# Altium project cycloon.PrjPcb
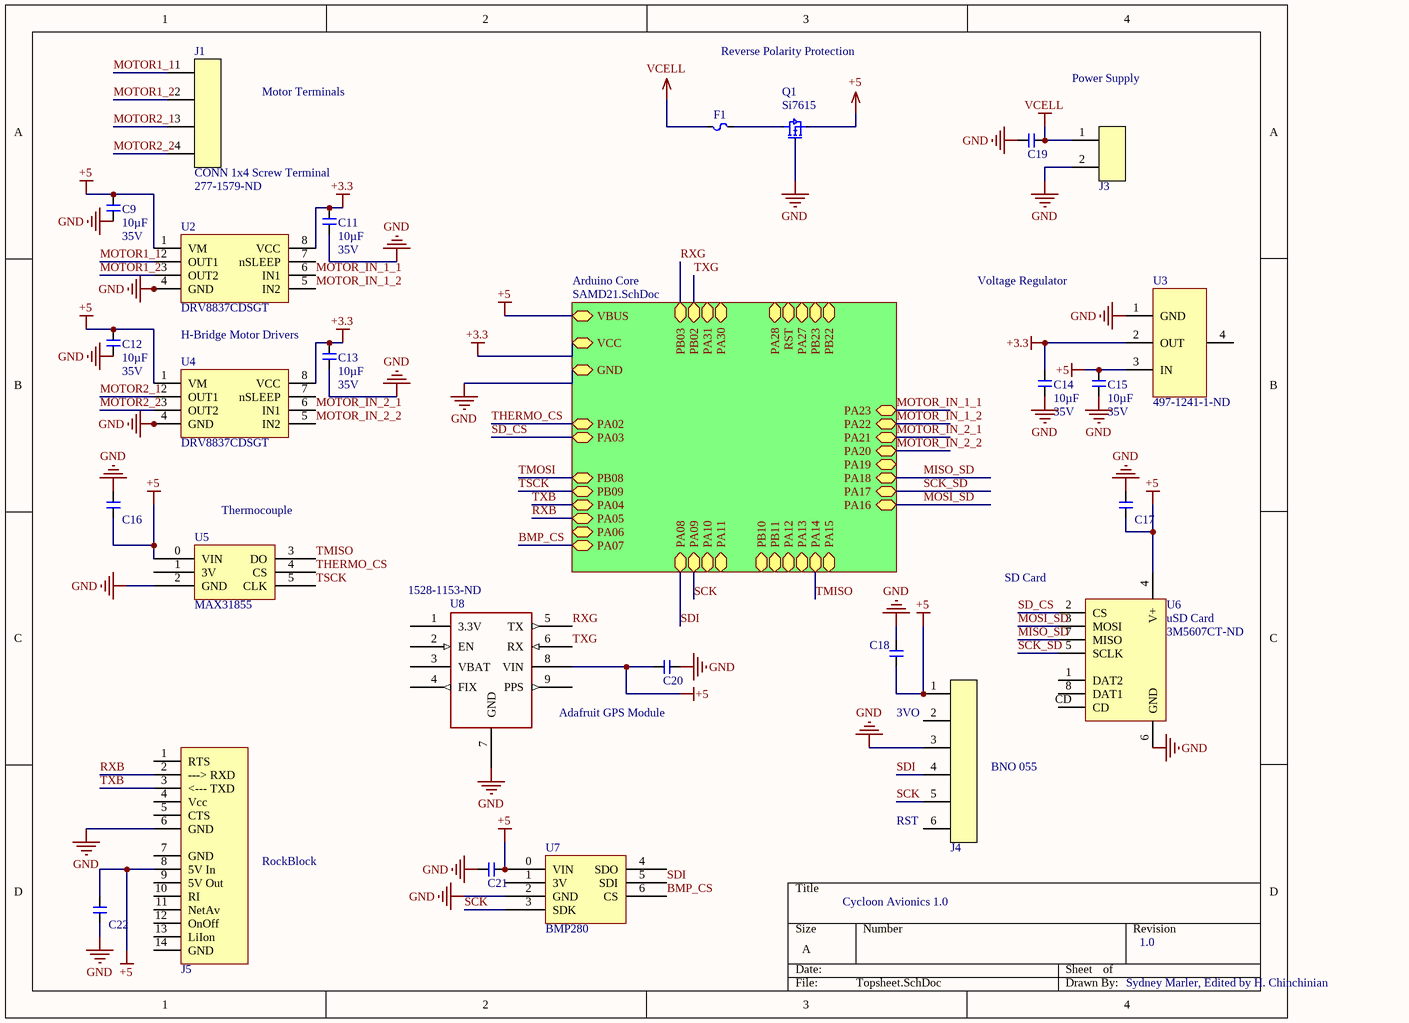
[diagram p0: Topsheet.SchDoc]
2 sheets, 43 parts. Net scope: hierarchical (ports join the sheet entries above them; power ports are global).
Board file: cycloonboard.PcbDoc
Sheets:
  Topsheet.SchDoc
    Arduino Core = SAMD21.SchDoc

## Sheet Topsheet.SchDoc
size A

### Parts
C9  Capacitance (shorthand): 10µF  Rated Voltage: 35V  [C0603]  (hidden comment: __template_cap)
C11  Capacitance (shorthand): 10µF  Rated Voltage: 35V  [C0603]  (hidden comment: __template_cap)
C12  Capacitance (shorthand): 10µF  Rated Voltage: 35V  [C0603]  (hidden comment: __template_cap)
C13  Capacitance (shorthand): 10µF  Rated Voltage: 35V  [C0603]  (hidden comment: __template_cap)
C14  Capacitance (shorthand): 10µF  Rated Voltage: 35V  [C0603]  (hidden comment: __template_cap)
C15  Capacitance (shorthand): 10µF  Rated Voltage: 35V  [C0603]  (hidden comment: __template_cap)
C16  __template_cap  [C0603]  (value not drawn)
C17  __template_cap  [C0603]  (value not drawn)
C18  __template_cap  [C0603]  (value not drawn)
C19  __template_cap  [C0603]  (value not drawn)
C20  __template_cap  [C0603]  (value not drawn)
C21  __template_cap  [C0603]  (value not drawn)
C22  __template_cap  [C0603]  (value not drawn)
F1  __template_fuse  [R1206]  (value not drawn)
J1  CONN 1x4 Screw Terminal  Supplier Part Number 1: 277-1579-ND  [CONN_1x4_5mm]
J3  CONN HEADER 2POS VERT T/H  [CONN_1x2_100MIL]  (value not drawn)
J4  CONN HEADER 6POS T/H  [CONN_1x6_100MIL]  (value not drawn)
J5  ROCKBLOCK_V2  [ROCKBLOCK_V2]  (value not drawn)
Q1  Si7615  [POWERPAK_1212-8_SINGLE]
U2  DRV8837CDSGT  [8WSON]
U3  Supplier Part Number 1: 497-1241-1-ND  [4SOT223]  (hidden comment: LDO_LD1117S33CTR)
U4  DRV8837CDSGT  [8WSON]
U5  MAX31855  [ADAFRUIT_THERMOCOUPLE_BREAKOUT]
U6  uSD Card  Supplier Part Number 1: 3M5607CT-ND  [MICROSD_CARD_SOCKET]
U7  BMP280  [ADAFRUIT_BMP280_BREAKOUT]
U8  Adafruit GPS Module  Supplier Part Number 1: 1528-1153-ND  [adafruit_gps_746]

### Sub-sheets
Arduino Core = SAMD21.SchDoc: PB10 (bidir), PA15 (bidir), PA12 (bidir), GND (bidir), RST (bidir), PA28 (bidir), PA08 (bidir), PA09 (bidir), PA10 (bidir), VCC (bidir), PA11 (bidir), PB11 (bidir), PA13 (bidir), PA14 (bidir), PA02 (bidir), PA03 (bidir), PB08 (bidir), PB09 (bidir), PA04 (bidir), PA05 (bidir), PA06 (bidir), PA07 (bidir), PA17 (bidir), PA18 (bidir), PA19 (bidir), PA20 (bidir), PA21 (bidir), PA22 (bidir), PA23 (bidir), PA30 (bidir), PB23 (bidir), PB22 (bidir), PA27 (bidir), PA31 (bidir), VBUS (bidir), PB03 (bidir), PB02 (bidir), PA16 (bidir)

### Nets
+3.3: C11.1 C13.1 C14.1 U2.8(VCC) U3.2(OUT) U4.8(VCC) ; sheet Arduino Core/VCC  [project net VCC]
+5: C9.1 C12.1 C15.1 C16.2 C17.2 C18.2 C20.1 C21.2 C22.1 J4.1 J5.8(5V_In) Q1.2 U2.1(VM) U3.3(IN) U4.1(VM) U5.0(VIN) U6.4(V+) U7.0(VIN) U8.8(VIN) ; sheet Arduino Core/VBUS  [project net VBUS]
GND: C9.2 C11.2 C12.2 C13.2 C14.2 C15.2 C16.1 C17.1 C18.1 C19.1 C20.2 C21.1 C22.2 J3.2 J4.3 J5.6(GND) Q1.1 U2.4(GND) U2.PAD U3.1(GND) U4.4(GND) U4.PAD U5.2(GND) U6.6(GND) U7.2(GND) U8.7(GND) ; sheet Arduino Core/GND  [project net AGND]
VCELL: C19.2 F1.1 J3.1
BMP_CS: U7.6(CS) ; sheet Arduino Core/PA07
MISO_SD: U6.7(MISO) ; sheet Arduino Core/PA18
MOSI_SD: U6.3(MOSI) ; sheet Arduino Core/PA16
MOTOR1_1: J1.1 U2.2(OUT1)
MOTOR1_2: J1.2 U2.3(OUT2)
MOTOR2_1: J1.3 U4.2(OUT1)
MOTOR2_2: J1.4 U4.3(OUT2)
MOTOR_IN_1_1: U2.6(IN1) ; sheet Arduino Core/PA23
MOTOR_IN_1_2: U2.5(IN2) ; sheet Arduino Core/PA22
MOTOR_IN_2_1: U4.6(IN1) ; sheet Arduino Core/PA21
MOTOR_IN_2_2: U4.5(IN2) ; sheet Arduino Core/PA20
RXB: J5.2(--->_RXD) ; sheet Arduino Core/PA05
RXG: U8.5(TX) ; sheet Arduino Core/PB03
SCK: J4.5 U7.3(SDK) ; sheet Arduino Core/PA09
SCK_SD: U6.5(SCLK) ; sheet Arduino Core/PA17
SD_CS: U6.2(CS) ; sheet Arduino Core/PA03
SDI: J4.4 U7.5(SDI) ; sheet Arduino Core/PA08
THERMO_CS: U5.4(CS) ; sheet Arduino Core/PA02
TMISO: U5.3(DO) ; sheet Arduino Core/PA14
TSCK: U5.5(CLK) ; sheet Arduino Core/PB09
TXB: J5.3(<---_TXD) ; sheet Arduino Core/PA04
TXG: U8.6(RX) ; sheet Arduino Core/PB02
NetF1_2: F1.2 Q1.3

Not connected (* = marked no-connect by the designer): J4 2 6; J5 1(RTS) 4(Vcc) 5(CTS) 7(GND) 9(5V_Out) 10(RI) 11(NetAv) 12(OnOff) 13(LiIon) 14(GND); U2 7(nSLEEP); U3 4(GND); U4 7(nSLEEP); U5 1(3V); U6 1(DAT2) 8(DAT1) CD; U7 1(3V) 4(SDO); U8 1(3.3V) 2(EN) 3(VBAT) 4(FIX) 9(PPS)

### Notes on the sheet
- Motor Terminals
- Reverse Polarity Protection
- Power Supply
- Voltage Regulator
- (near C13) H-Bridge Motor Drivers
- (near U5) Thermocouple
- (near U6) SD Card
- 3VO
- (near J4) BNO 055
- (near J4) RST
- RockBlock
- Cycloon Avionics 1.0
- 1.0
- Sydney Marler, Edited by H. Chinchinian

### Library data of the parts
C9 C11-C15 = 490-13248-1-ND: CAP CER 10UF 35V X5R 0603 20%; Manufacturer: Murata Electronics North America; Capacitance - pF (Machine readable): #NAME?; type: capacitor; Supplier Part Number 1: 490-13248-1-ND; Dielectric: X5R; Supplier 1: Digikey
F1 = CMP-035-0003-1: Source: fuse.SchLib; Design Item ID: __template_fuse
J1 = CONN_1x4_PhoenixContact_1935187: CONN 1x4 Screw Terminal: Phoenix Contact 1935187; ComponentLink1Description: Digikey part; ComponentLink1URL: https://www.digikey.com/product-detail/en/phoenix-contact/1935187/277-1579-ND/568616; Supplier 1: Digi-Key
J3 = CONN_1x2: Manufacturer: FCI; Manufacturer Part Number: 77311-118-02LF; Connector Type: Header, Unshrouded; Number of Positions: 2; Number of Positions Loaded: All; Pitch: 0.100" (2.54mm); RoHS: RoHS Compliant; Category: Connectors, Interconnects; Packaging: Bulk; Contact Type: Male Pin; Number of Rows: 1; Mounting Type: Through Hole; Termination: Solder; Fastening Type: -; Features: -; ComponentLink1URL: http://portal.fciconnect.com/res/en/pdffiles/doc_search//77311.pdf; ComponentLink1Description: http://portal.fciconnect.com/res/en/pdffiles/doc_search//77311.pdf; Row Spacing: -; Contact Mating Length: 0.230" (5.84mm); Contact Finish: Gold, GXT™; Contact Finish Thickness: 30µin (0.76µm); Color: Black
J4 = CONN_1x6
J5 = ROCKBLOCK_V2: CHILD OF SATAN, SOURCE OF BOTH TREMENDOUS FORTUNE AND UNSPEAKABLE ANGUISH; ComponentLink1Description: Developer's Guide; ComponentLink1URL: https://www.rock7.com/downloads/RockBLOCK-Developer-Guide-Mk2.pdf
Q1 = PFET_SI7615ADN-T1: MOSFET P-CH 20V 35A PPK; pin to pad: 1>4 2>1 3>5; Manufacturer: Vishay Siliconix; Manufacturer Part Number: SI7615ADN-T1-GE3; FET Type: MOSFET P-Channel, Metal Oxide; FET Feature: Standard; Current - Continuous Drain (Id) @ 25°C: 35A (Tc); Rds On (Max) @ Id, Vgs: 4.4 mOhm @ 20A, 10V; Vgs(th) (Max) @ Id: 1.5V @ 250µA; Gate Charge (Qg) @ Vgs: 183nC @ 10V; Input Capacitance (Ciss) @ Vds: 5590pF @ 10V; Power - Max: 52W; Supplier 1: Digi-Key; Supplier Part Number 1: SI7615ADN-T1-GE3CT-ND; RoHS: RoHS Compliant; Category: Discrete Semiconductor Products; Stock 1: 98451; Pricing 1: 1=0.73, 10=0.646, 25=0.6068, 100=0.4951, 250=0.45988, 500=0.3914, 1000=0.31312 (USD); Packaging: Cut Tape (CT); Part Status: Active; Drain to Source Voltage (Vdss): 20V; Operating Temperature: -55°C ~ 150°C (TJ); Mounting Type: Surface Mount; Package / Case: PowerPAK® 1212-8; Supplier Device Package: PowerPAK® 1212-8; ComponentLink1URL: http://www.vishay.com/docs/62667/si7615adn.pdf; ComponentLink1Description: http://www.vishay.com/docs/62667/si7615adn.pdf
U2 U4 = MOTOR_HBRIDGE_DRV8837C: MOTOR DRIVER 1A; Manufacturer: Texas Instruments; Output Configuration: Half Bridge (2); Interface: PWM; Load Type: Inductive; Rds On (Typ): 1 Ohm LS + HS; Voltage - Supply: 1.8 V ~ 7 V; Voltage - Load: 0 V ~ 11 V; Fault Protection: Current Limiting, Over Temperature, Short Circuit, UVLO; Supplier 1: Digi-Key; Manufacturer Part Number: DRV8837CDSGT; RoHS: RoHS Compliant; Category: Integrated Circuits (ICs); Stock 1: 1424; Pricing 1: 1=1.28, 10=1.146, 100=0.8931 (USD); Packaging: Cut Tape (CT); Part Status: Active; Applications: DC Motors, Solenoids; Technology: NMOS; Current - Output / Channel: -; Current - Peak Output: 1A; Operating Temperature: -40°C ~ 150°C (TJ); Features: -; Mounting Type: Surface Mount; Package / Case: 8-WFDFN Exposed Pad; Supplier Device Package: 8-WSON (2x2); ComponentLink1URL: http://www.ti.com/lit/ds/symlink/drv8837c.pdf; ComponentLink1Description: http://www.ti.com/lit/ds/symlink/drv8837c.pdf; Supplier Part Number 1: 296-44747-1-ND
U3 = LDO_LD1117S33CTR: IC VOLTAGE REG 3.3V 800MA SOT223 INDUSTRIAL TEMP; Manufacturer: STMicroelectronics; Regulator Topology: Positive Fixed; Voltage - Dropout (Typical): 1.1V @ 800mA; Number of Regulators: 1; Voltage - Input: Up to 15V; Supplier 1: Digi-Key; Manufacturer Part Number: LD1117S33CTR; RoHS: RoHS Compliant; Category: Integrated Circuits (ICs); Stock 1: 63873; Pricing 1: 1=0.46, 10=0.373, 100=0.2538, 500=0.19034, 1000=0.14276 (USD); Packaging: Cut Tape (CT); Part Status: Active; Voltage - Output: 3.3V; Current - Output: 800mA; Current - Limit (Min): -; Operating Temperature: -40°C ~ 125°C; Mounting Type: Surface Mount; Package / Case: TO-261-4, TO-261AA; Supplier Device Package: SOT-223; ComponentLink1URL: http://www.st.com/content/ccc/resource/technical/document/datasheet/99/3b/7d/91/91/51/4b/be/CD00000544.pdf/files/CD00000544.pdf/jcr:content/translations/en.CD00000544.pdf; ComponentLink1Description: http://www.st.com/content/ccc/resource/technical/document/datasheet/99/3b/7d/91/91/51/4b/be/CD00000544.pdf/files/CD00000544.pdf/jcr:content/translations/en.CD00000544.pdf
U5 = ADAFRUIT_THERMOCOUPLE_BREAKOUT
U6 = MICRO_SD_CARD_HOLDER: MICROSD CARD HOLDER, PUSH-PUSH; pin to pad: 6>6+SHIELD1+SHIELD2+SHIELD3; Manufacturer: 3M; Manufacturer Part Number: 2908-05WB-MG; Card Type: Secure Digital - microSD™; Number of Positions: 10 (8 + 2); Connector Type: Connector and Ejector; Insertion, Removal Method: Push In, Push Out; Supplier 1: Digi-Key; RoHS: RoHS Compliant; Category: Connectors, Interconnects; Stock 1: 32313; Pricing 1: 1=3.6, 10=3.458, 25=3.1704, 50=3.0262, 100=2.882, 250=2.52176, 500=2.4497, 1000=2.08945 (USD); Packaging: Cut Tape (CT); Ejector Side: -; Mounting Type: Surface Mount, Right Angle; Features: Switch; Height Above Board: 0.073" (1.85mm); Mounting Feature: Normal, Standard - Top; Contact Finish: Gold; Contact Finish Thickness: 15µin (0.38µm); ComponentLink1URL: http://multimedia.3m.com/mws/media/416257O/3mtm-card-connector-microsdtm-2900-series-ts2197.pdf; ComponentLink1Description: http://multimedia.3m.com/mws/media/416257O/3mtm-card-connector-microsdtm-2900-series-ts2197.pdf
U7 = ADAFRUIT_BMP280_BREAKOUT
U8 = ADAFRUIT_GPS_746: https://www.adafruit.com/product/746; ComponentLink1Description: Adafruit GPS Module; ComponentLink1URL: https://www.adafruit.com/product/746; Supplier 1: Digi-Key

## Sheet SAMD21.SchDoc
size A
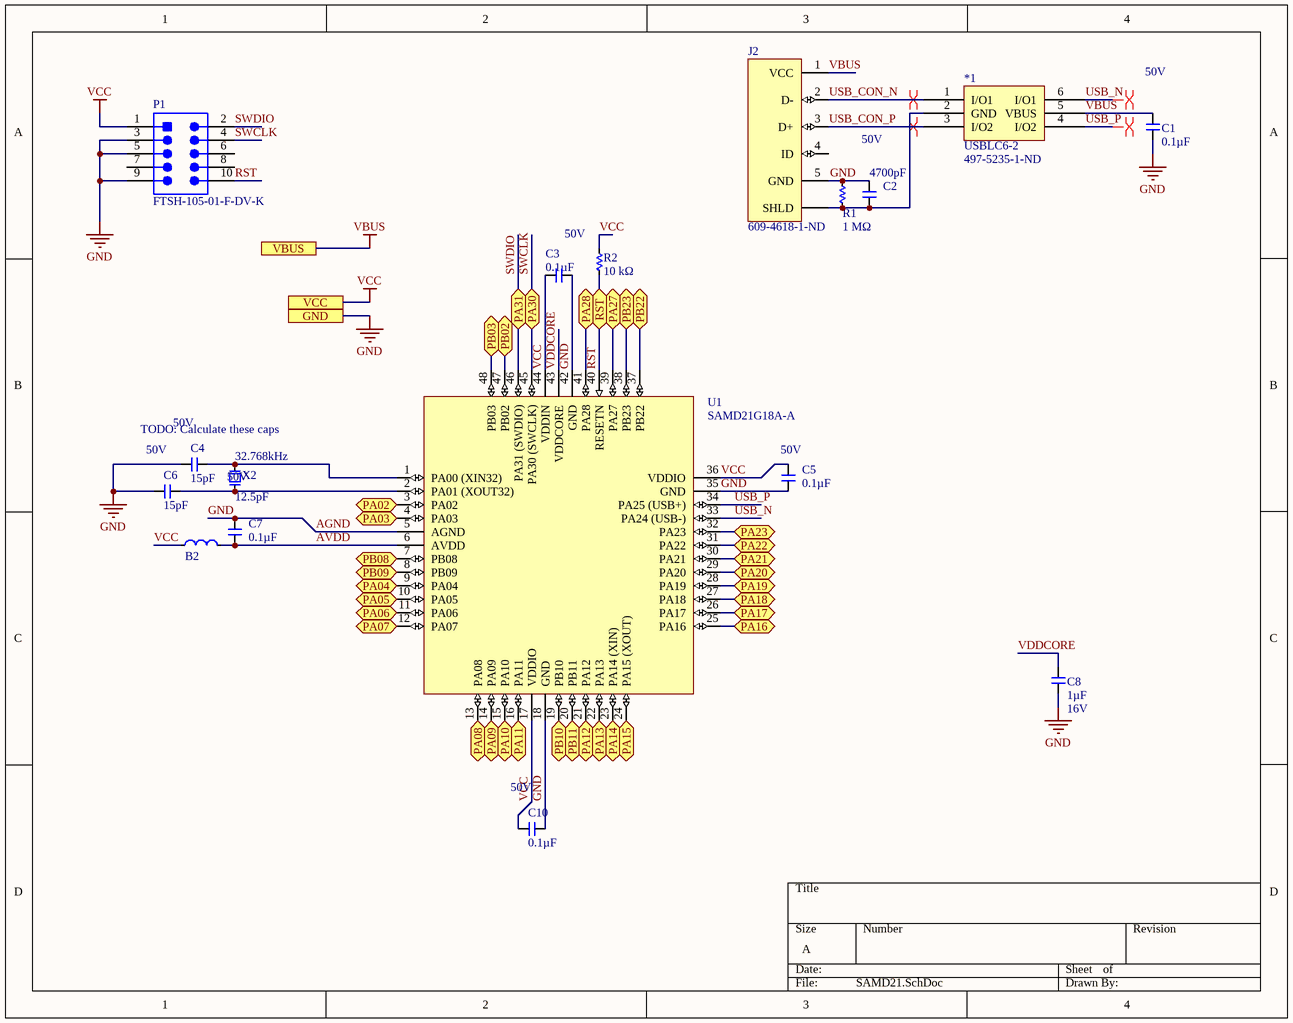
[diagram p1: SAMD21.SchDoc]

### Parts
*1  USBLC6-2  Supplier Part Number 1: 497-5235-1-ND  [6SOT23]
B2  FB_1608  [R0603]  (value not drawn)
C1  Capacitance (shorthand): 0.1µF  Rated Voltage: 50V  [C0603]  (hidden comment: __template_cap)
C2  Capacitance (shorthand): 4700pF  Rated Voltage: 50V  [C0603]  (hidden comment: __template_cap)
C3  Capacitance (shorthand): 0.1µF  Rated Voltage: 50V  [C0603]  (hidden comment: __template_cap)
C4  Capacitance (shorthand): 15pF  Rated Voltage: 50V  [C0603]  (hidden comment: __template_cap)
C5  Capacitance (shorthand): 0.1µF  Rated Voltage: 50V  [C0603]  (hidden comment: __template_cap)
C6  Capacitance (shorthand): 15pF  Rated Voltage: 50V  [C0603]  (hidden comment: __template_cap)
C7  Capacitance (shorthand): 0.1µF  Rated Voltage: 50V  [C0603]  (hidden comment: __template_cap)
C8  Capacitance (shorthand): 1µF  Rated Voltage: 16V  [C0603]  (hidden comment: __template_cap)
C10  Capacitance (shorthand): 0.1µF  Rated Voltage: 50V  [C0603]  (hidden comment: __template_cap)
J2  Supplier Part Number 1: 609-4618-1-ND  [CONN_USBMICROB_10118194-0001LF]  (hidden comment: CONN_USB_MICROB_SMD_TH_R/A)
P1  FTSH-105-01-F-DV-K  [SMTC-FTSH-105-01-L-DV-K_V]
R1  Resistance: 1 MΩ  [R0603]  (hidden comment: __template_resistor)
R2  Resistance: 10 kΩ  [R0603]  (hidden comment: __template_resistor)
U1  SAMD21G18A-A  [SAMD21 TQFP-48]
X2  Frequency: 32.768kHz  Load Capacitance: 12.5pF  [XTAL_TXC_9HT10]  (hidden comment: XTAL_9HT10-32.768KEZF-T)

### Ports
GND, PA02 (bidir), PA03 (bidir), PA04 (bidir), PA05 (bidir), PA06 (bidir), PA07 (bidir), PA08 (bidir), PA09 (bidir), PA10 (bidir), PA11 (bidir), PA12 (bidir), PA13 (bidir), PA14 (bidir), PA15 (bidir), PA16 (bidir), PA17 (bidir), PA18 (bidir), PA19 (bidir), PA20 (bidir), PA21 (bidir), PA22 (bidir), PA23 (bidir), PA27 (bidir), PA28 (bidir), PA30 (bidir), PA31 (bidir), PB02 (bidir), PB03 (bidir), PB08 (bidir), PB09 (bidir), PB10 (bidir), PB11 (bidir), PB22 (bidir), PB23 (bidir), RST (bidir), VBUS, VCC

### Nets
AGND: C1.2 C2.1 C3.1 C4.1 C5.1 C6.1 C7.1 C8.2 C10.2 J2.5(GND) P1.3 P1.5 P1.9 R1.2 U1.5(AGND) U1.18(GND) U1.35(GND) U1.42(GND) ; port GND  [also labelled GND]
VBUS: *1.5(VBUS) C1.1 J2.1(VCC) ; port VBUS
VCC: B2.1 C3.2 C5.2 C10.1 P1.1 R2.2 U1.17(VDDIO) U1.36(VDDIO) U1.44(VDDIN) ; port VCC
AVDD: B2.2 C7.2 U1.6(AVDD)
BMP_CS: U1.12(PA07) ; port PA07
MISO_SD: U1.27(PA18) ; port PA18
MOSI_SD: U1.25(PA16) ; port PA16
MOTOR_IN_1_1: U1.32(PA23) ; port PA23
MOTOR_IN_1_2: U1.31(PA22) ; port PA22
MOTOR_IN_2_1: U1.30(PA21) ; port PA21
MOTOR_IN_2_2: U1.29(PA20) ; port PA20
RST: P1.10 R2.1 U1.40(RESETN) ; port RST
RXB: U1.10(PA05) ; port PA05
RXG: U1.48(PB03) ; port PB03
SCK: U1.14(PA09) ; port PA09
SCK_SD: U1.26(PA17) ; port PA17
SD_CS: U1.4(PA03) ; port PA03
SDI: U1.13(PA08) ; port PA08
SWCLK: P1.4 U1.45(PA30_(SWCLK)) ; port PA30
SWDIO: P1.2 U1.46(PA31_(SWDIO)) ; port PA31
THERMO_CS: U1.3(PA02) ; port PA02
TMISO: U1.23(PA14_(XIN)) ; port PA14
TMOSI: U1.7(PB08) ; port PB08
TSCK: U1.8(PB09) ; port PB09
TXB: U1.9(PA04) ; port PA04
TXG: U1.47(PB02) ; port PB02
USB_CON_N: *1.1(I/O1) J2.2(D-)
USB_CON_P: *1.3(I/O2) J2.3(D+)
USB_N: *1.6(I/O1) U1.33(PA24_(USB-))
USB_P: *1.4(I/O2) U1.34(PA25_(USB+))
VDDCORE: C8.1 U1.43(VDDCORE)
Net*1_2: *1.2(GND) C2.2 J2.SHIELD(SHLD) R1.1
NetC4_2: C4.2 U1.1(PA00_(XIN32)) X2.2
NetC6_2: C6.2 U1.2(PA01_(XOUT32)) X2.1
NetU1_11: U1.11(PA06) ; port PA06
NetU1_15: U1.15(PA10) ; port PA10
NetU1_16: U1.16(PA11) ; port PA11
NetU1_19: U1.19(PB10) ; port PB10
NetU1_20: U1.20(PB11) ; port PB11
NetU1_21: U1.21(PA12) ; port PA12
NetU1_22: U1.22(PA13) ; port PA13
NetU1_24: U1.24(PA15_(XOUT)) ; port PA15
NetU1_28: U1.28(PA19) ; port PA19
NetU1_37: U1.37(PB22) ; port PB22
NetU1_38: U1.38(PB23) ; port PB23
NetU1_39: U1.39(PA27) ; port PA27
NetU1_41: U1.41(PA28) ; port PA28

Not connected (* = marked no-connect by the designer): J2 4(ID); P1 6 7 8

### Layout directives
differential pair: USB_CON_N, USB_CON_P, USB_N, USB_P

### Notes on the sheet
- TODO: Calculate these caps

### Library data of the parts
*1 = USBLC6-2: Manufacturer: STMicroelectronics; Manufacturer Part Number: USBLC6-2SC6; Unidirectional Channels: 2; Voltage - Reverse Standoff (Typ): 5.25V; Voltage - Breakdown (Min): 6V; Voltage - Clamping (Max) @ Ipp: 17V; Current - Peak Pulse (10/1000µs): 5A (8/20µs); Power Line Protection: Yes; Supplier 1: Digi-Key; RoHS: RoHS Compliant; Category: Circuit Protection; Stock 1: 31719; Pricing 1: 1=0.51, 10=0.411, 100=0.2802, 500=0.21012, 1000=0.15759 (USD); Packaging: Cut Tape (CT); Part Status: Active; Type: Steering (Rail to Rail); Bidirectional Channels: -; Power - Peak Pulse: -; Applications: Ethernet; Capacitance @ Frequency: -; Operating Temperature: -40°C ~ 125°C (TJ); Mounting Type: Surface Mount; Package / Case: SOT-23-6; Supplier Device Package: SOT-23-6; ComponentLink1URL: http://www.st.com/web/en/resource/technical/document/datasheet/CD00050750.pdf; ComponentLink1Description: http://www.st.com/web/en/resource/technical/document/datasheet/CD00050750.pdf
B2 = FB_1608: FERRITE BEAD 600 OHM 300mA; Manufacturer: Taiyo Yuden; Manufacturer Part Number: BK1608HW601-T; Number of Lines: 1; Impedance @ Frequency: 600 Ohm @ 100MHz; DC Resistance (DCR) (Max): 400 mOhm; Supplier 1: Digi-Key; Supplier Part Number 1: 587-1879-1-ND; RoHS: RoHS Compliant; Category: Filters; Stock 1: 11908; Pricing 1: 1=0.1, 10=0.059, 50=0.0474, 100=0.0426, 250=0.0312, 500=0.0227, 1000=0.02223 (USD); Packaging: Cut Tape (CT); Part Status: Active; Filter Type: -; Current Rating (Max): 300mA; Ratings: -; Operating Temperature: -55°C ~ 125°C; Package / Case: 0603 (1608 Metric); Mounting Type: Surface Mount; Height (Max): 0.037" (0.95mm); Size / Dimension: 0.063" L x 0.031" W (1.60mm x 0.80mm); ComponentLink1URL: http://ds.yuden.co.jp/TYCOMPAS/ut/detail.do?productNo=BK1608HW601-T&fileName=BK1608HW601-T_SS&mode=specSheetDownload; ComponentLink1Description: http://ds.yuden.co.jp/TYCOMPAS/ut/detail.do?productNo=BK1608HW601-T&fileName=BK1608HW601-T_SS&mode=specSheetDownload
C1 C3 C5 C7 C10 = 490-1519-1-ND: CAP CER 0603 0.1µF X7R 50V 10%; Manufacturer: Murata Electronics North America; Capacitance - pF (Machine readable): #NAME?; type: capacitor; Dielectric: X7R; Supplier 1: Digikey; Supplier Part Number 1: 490-1519-1-ND
C2 = 490-1506-1-ND: CAP CER 0603 4700pF X7R 50V 10%; Manufacturer: Murata Electronics North America; Capacitance - pF (Machine readable): #NAME?; type: capacitor; Dielectric: X7R; Supplier 1: Digikey; Supplier Part Number 1: 490-1506-1-ND
C4 C6 = 490-1407-1-ND: CAP CER 15PF 50V C0G/NP0 0603; Manufacturer: Murata Electronics North America; Capacitance - pF (Machine readable): 15; type: capacitor; Dielectric: C0G, NP0; Supplier 1: Digikey; Supplier Part Number 1: 490-1407-1-ND
C8 = 490-3900-1-ND: CAP CER 0603 1µF X7R 16V 10%; Manufacturer: Murata Electronics North America; Capacitance - pF (Machine readable): #NAME?; type: capacitor; Dielectric: X7R; Supplier 1: Digikey; Supplier Part Number 1: 490-3900-1-ND
J2 = CONN_USB_MICROB_SMD_TH_R/A: CONN RCPT USB2.0 MICRO B SMD R/A; Manufacturer: Amphenol FCI; Manufacturer Part Number: 10118194-0001LF; Gender: Receptacle; Current Rating: 1.8A; Connector Type: USB,Receptacle; Number of Contacts: 5; Insulation Resistance: 1GR; Number of Ports: 1; Max Voltage Rating (AC): 100V; Pitch: 0.65mm; Supplier 1: Digi-Key; Stock 1: 180464; Pricing 1: 1=0.46, 10=0.437, 25=0.3744, 50=0.318, 100=0.3056, 250=0.2744, 500=0.262 (USD); Mount: Surface Mount,Horizontal; Contact Material: Copper Alloy; Contact Plating: Nickel,Gold; Number of Terminals: 5; Housing Material: Polymer; Colour: Black; Min Operating Temperature: -55°C; Max Operating Temperature: 85°C; Package Quantity: 9600; Packaging: Tape and Reel; Termination: Solder; Orientation: Right Angle; Length: 8.05mm; Depth: 5mm; Radiation Hardening: No; Lead Free: Lead Free; Flammability Rating: UL94 V-0; ComponentLink1URL: https://datasheet.ciiva.com/851/10118194-851110.pdf; ComponentLink1Description: https://datasheet.ciiva.com/851/10118194-851110.pdf; ComponentLink2URL: https://datasheet.ciiva.com/851/10118194-851111.pdf; ComponentLink2Description: https://datasheet.ciiva.com/851/10118194-851111.pdf; ComponentLink3URL: https://datasheet.ciiva.com/4598/10118194ac-197217-4598807.pdf; ComponentLink3Description: https://datasheet.ciiva.com/4598/10118194ac-197217-4598807.pdf; ComponentLink4URL: https://datasheet.ciiva.com/29907/10118194-29907230.pdf; ComponentLink4Description: https://datasheet.ciiva.com/29907/10118194-29907230.pdf; ComponentLink5URL: https://datasheet.ciiva.com/26945/getdatasheetpartid-418619-26945695.pdf; ComponentLink5Description: https://datasheet.ciiva.com/26945/getdatasheetpartid-418619-26945695.pdf
P1 = CMP-2000-05352-1: Male Header, Pitch 1.27 mm, 2 x 5 Position, Height 6.12 mm, RoHS, Tube; Manufacturer: Samtec; Number of Positions: 10; Connector Type: Header,Shrouded; Number of Positions Loaded: All; Row Spacing: 0.050"(1.27mm); Fastening Type: -; Package Reference: FTSH-105-01-L-DV-K; Termination: Solder; Package URL: http://suddendocs.samtec.com/prints/ftsh-1xx-xx-xxx-dv-xxx-footprint.pdf; Number of Rows: 2; Contact Finish Thickness: 3µin(0.08µm); Contact Type: MalePin; Manufacturer URL: http://www.samtec.com/; Series: FTSH; Features: -; Contact Finish: Gold; Color: Black; Family: RectangularConnectors-Headers,MalePins; Datasheet URL: http://suddendocs.samtec.com/prints/ftsh-1xx-xx-xxx-dv-xxx-mkt.pdf; Package Description: Male Header, Pitch 1.27 mm, 2 x 5 Position, Height 5.97 mm, Tail Length 4.32 mm; Mounting Type: SurfaceMount; Datasheet Version: Rev. ET, 10/1995; Category: Connectors,Interconnects; Packaging: Tube; Contact Mating Length: 0.120"(3.05mm); Pitch: 0.050"(1.27mm)
R1 = 311-1.00MHRCT-ND: RES SMD 1M OHM 1% 1/10W 0603; Manufacturer Part Number: RC0603FR-071ML; Manufacturer: Yageo; Resistance (Sortable): 1000000; Power (Watts): 0.1W, 1/10W; Temperature Coefficient: ±100ppm/°C; Supplier 1: Digikey; Datasheets: http://www.yageo.com/documents/recent/PYu-RC_Group_51_RoHS_L_9.pdf; Image: //media.digikey.com/Renders/Yageo%20Renders/0603-(1608-Metric).jpg; Supplier Part Number 1: 311-1.00MHRCT-ND; Tolerance: ±1%; Operating Temperature: -55°C ~ 155°C
R2 = 311-10.0KHRCT-ND: RES SMD 10K OHM 1% 1/10W 0603; Manufacturer Part Number: RC0603FR-0710KL; Manufacturer: Yageo; Resistance (Sortable): 10000; Power (Watts): 0.1W, 1/10W; Temperature Coefficient: ±100ppm/°C; Supplier 1: Digikey; Datasheets: http://www.yageo.com/documents/recent/PYu-RC_Group_51_RoHS_L_9.pdf; Image: //media.digikey.com/Renders/Yageo%20Renders/0603-(1608-Metric).jpg; Supplier Part Number 1: 311-10.0KHRCT-ND; Tolerance: ±1%; Operating Temperature: -55°C ~ 155°C
U1 = SAMD21G18A-A: 48Mhz Atmel SAM ARM Cortex M0+; ComponentLink1Description: Product Page; ComponentLink1URL: https://www.microchip.com/wwwproducts/en/ATSAMD21G18; ComponentLink2Description: Datasheet; ComponentLink2URL: http://ww1.microchip.com/downloads/en/DeviceDoc/SAM-D21-Family-Datasheet-DS40001882C.pdf; Supplier 1: Digi-Key; Supplier Part Number 1: ATSAMD21G18A-AU-ND
X2 = XTAL_9HT10-32.768KEZF-T: CRYSTAL 32.768 KHZ 12.5 PF SMD; Manufacturer: TXC CORPORATION; Frequency Tolerance: ±10ppm; ESR (Equivalent Series Resistance): 70 kOhm; Operating Mode: Fundamental; Supplier 1: Digi-Key; Manufacturer Part Number: 9HT10-32.768KEZF-T; RoHS: RoHS Compliant; Category: Crystals and Oscillators; Stock 1: 5250; Pricing 1: 1=1.88, 10=1.625, 50=1.425, 100=1.125, 500=0.95, 1000=0.75 (USD); Type: kHz Crystal (Tuning Fork); Frequency Stability: -; Operating Temperature: -40°C ~ 85°C; Ratings: -; Mounting Type: Surface Mount; Package / Case: 2-SMD; Size / Dimension: 0.126" L x 0.059" W (3.20mm x 1.50mm); Height: 0.033" (0.85mm); Packaging: Cut Tape (CT); ComponentLink1URL: http://www.txccrystal.com/images/pdf/9ht10.pdf; ComponentLink1Description: Datasheet; Supplier Part Number 1: 887-1507-1-ND

## Nets that join several sheets
AGND: Topsheet (26 pins), SAMD21 (18 pins)
VBUS: Topsheet (19 pins), SAMD21 (*1.5 C1.1 J2.1)
VCC: Topsheet (6 pins), SAMD21 (9 pins)
BMP_CS: Topsheet (U7.6), SAMD21 (U1.12)
MISO_SD: Topsheet (U6.7), SAMD21 (U1.27)
MOSI_SD: Topsheet (U6.3), SAMD21 (U1.25)
MOTOR_IN_1_1: Topsheet (U2.6), SAMD21 (U1.32)
MOTOR_IN_1_2: Topsheet (U2.5), SAMD21 (U1.31)
MOTOR_IN_2_1: Topsheet (U4.6), SAMD21 (U1.30)
MOTOR_IN_2_2: Topsheet (U4.5), SAMD21 (U1.29)
RXB: Topsheet (J5.2), SAMD21 (U1.10)
RXG: Topsheet (U8.5), SAMD21 (U1.48)
SCK: Topsheet (J4.5 U7.3), SAMD21 (U1.14)
SCK_SD: Topsheet (U6.5), SAMD21 (U1.26)
SD_CS: Topsheet (U6.2), SAMD21 (U1.4)
SDI: Topsheet (J4.4 U7.5), SAMD21 (U1.13)
THERMO_CS: Topsheet (U5.4), SAMD21 (U1.3)
TMISO: Topsheet (U5.3), SAMD21 (U1.23)
TSCK: Topsheet (U5.5), SAMD21 (U1.8)
TXB: Topsheet (J5.3), SAMD21 (U1.9)
TXG: Topsheet (U8.6), SAMD21 (U1.47)